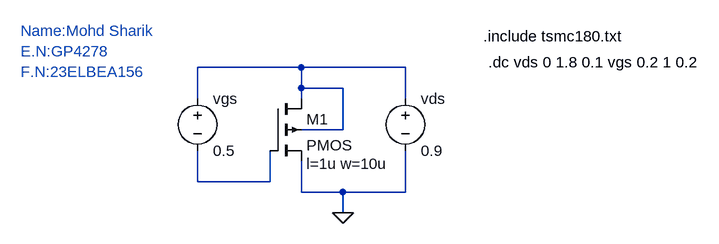
[diagram p0: schematic pmos.asc]
pmos.asc, the LTspice schematic file:
Version 4
SHEET 1 880 680
WIRE 160 144 0 144
WIRE 320 144 160 144
WIRE 160 176 160 144
WIRE 224 176 160 176
WIRE 0 192 0 144
WIRE 160 192 160 176
WIRE 320 192 320 144
WIRE 224 240 224 176
WIRE 224 240 160 240
WIRE 0 320 0 272
WIRE 112 320 112 272
WIRE 112 320 0 320
WIRE 160 336 160 288
WIRE 224 336 160 336
WIRE 320 336 320 272
WIRE 320 336 224 336
WIRE 224 368 224 336
FLAG 224 368 0
SYMBOL voltage 320 176 R0
SYMATTR InstName vds
SYMATTR Value 0.9
SYMBOL voltage 0 176 R0
SYMATTR InstName vgs
SYMATTR Value 0.5
SYMBOL pmos4 112 192 R0
WINDOW 123 56 100 Left 2
SYMATTR InstName M1
SYMATTR Value2 l=1u w=10u
TEXT 440 96 Left 2 !.include tsmc180.txt
TEXT 448 136 Left 2 !.dc vds 0 1.8 0.1 vgs 0.2 1 0.2
TEXT -272 88 Left 2 ;Name:Mohd Sharik\nE.N:GP4278\nF.N:23ELBEA156

The netlist it stands for:
* pmos.asc
vds N001 0 0.9
vgs N001 N002 0.5
M1 N001 N002 0 N001 PMOS l=1u w=10u
.model NMOS NMOS
.model PMOS PMOS
.lib standard.mos
.include tsmc180.txt
.dc vds 0 1.8 0.1 vgs 0.2 1 0.2
* Name:Mohd Sharik
* E.N:GP4278
* F.N:23ELBEA156
.backanno
.end